# Altium schematic sheet Accelerometer.SchDoc
size A
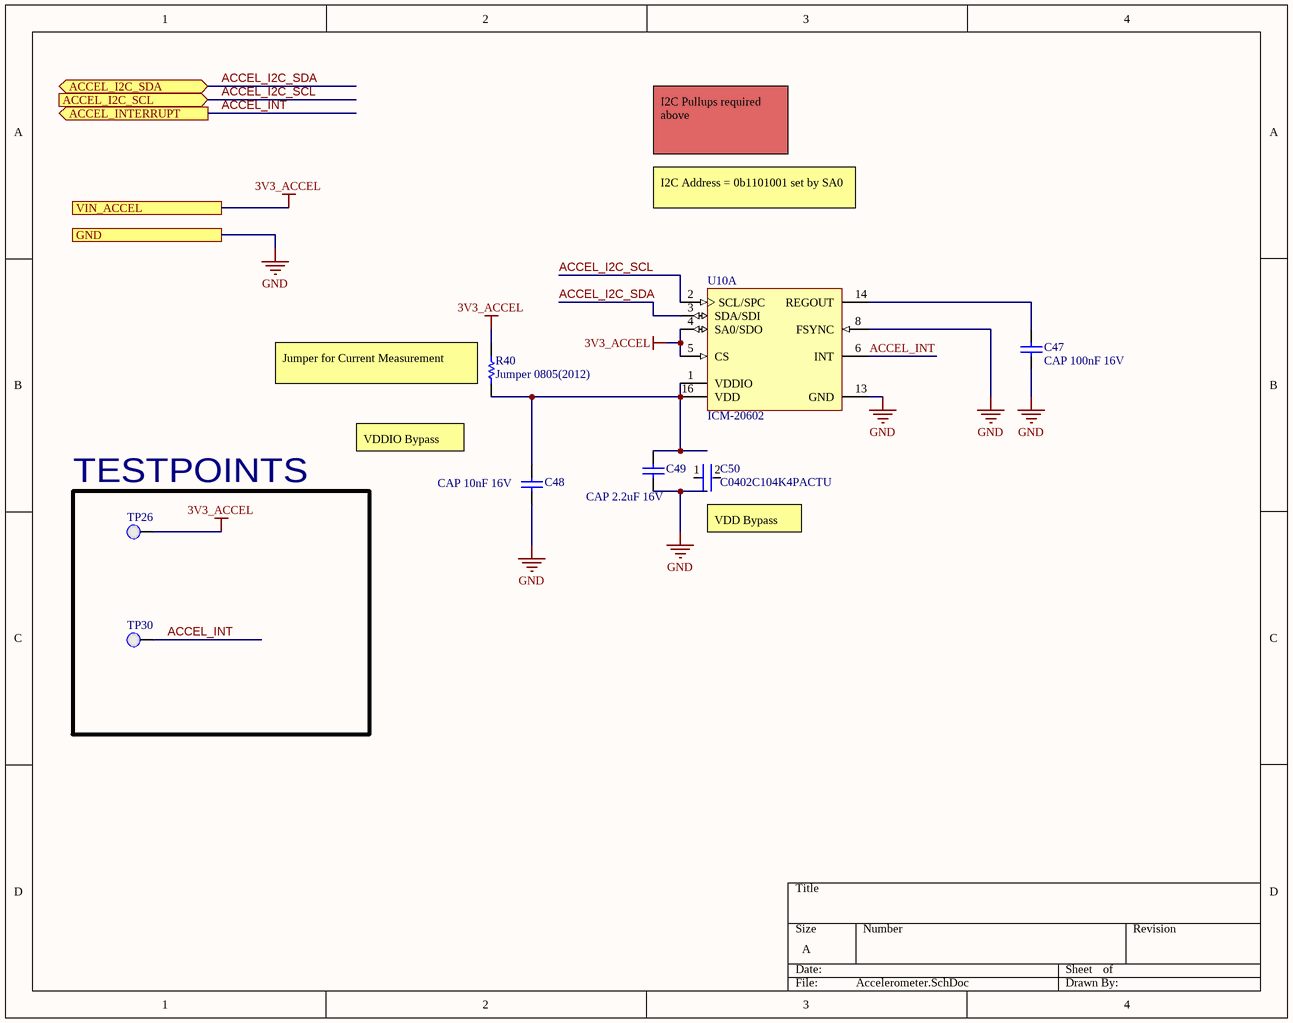
[diagram p0: Accelerometer.SchDoc]

## Parts
C47  CAP 100nF 16V  [CAPC0402(1005)60_M]
C48  CAP 10nF 16V  [CAPC0402(1005)33_L]
C49  CAP 2.2uF 16V  [CAPC0603(1608)100_L]
C50  C0402C104K4PACTU  [FP-C0402-BB-MFG]
R40  Jumper 0805(2012)  [RESC0805(2012)_N]
TP26  0.1" Pad  [PCBComponent]  (value not drawn)
TP30  0.1" Pad  [PCBComponent]  (value not drawn)
U10  ICM-20602  [INSE-I62-16]  (part A of 2)

## Blocks framed on the sheet
TESTPOINTS: TP26 TP30

## Ports
ACCEL_I2C_SCL (in), ACCEL_I2C_SDA (bidir), ACCEL_INTERRUPT (out), GND, VIN_ACCEL

## Nets
3V3_ACCEL: R40.1 TP26.1(PAD) U10.4(SA0/SDO) U10.5(CS) ; port VIN_ACCEL
GND: C47.1 C48.1 C49.1 U10.8(FSYNC) U10.13(GND) ; port GND
ACCEL_I2C_SCL: U10.2(SCL/SPC) ; port ACCEL_I2C_SCL
ACCEL_I2C_SDA: U10.3(SDA/SDI) ; port ACCEL_I2C_SDA
ACCEL_INT: TP30.1(PAD) U10.6(INT) ; port ACCEL_INTERRUPT
NetC47_2: C47.2 U10.14(REGOUT)
NetC48_2: C48.2 C49.2 R40.2 U10.1(VDDIO) U10.16(VDD)

Not connected (* = marked no-connect by the designer): C50 1 2

## Notes on the sheet
- I2C Pullups required above
- I2C Address = 0b1101001 set by SA0
- (near R40) Jumper for Current Measurement
- VDDIO Bypass
- (near C50) VDD Bypass

## Library data of the parts
C47 = CMP-1034-02069-1: CAP 100nF 16V ±10% 0402 (1005 Metric) Thickness 0.6mm SMD; Case-EIA: 0402; Case-Metric: 1005; Tolerance: Â±10%; Value: 100nF; Max Thickness: 0.6 mm; Rated Voltage: 16 V; Technology: SMT
C48 = CMP-1034-01875-1: CAP 10nF 16V ±10% 0402 (1005 Metric) Thickness 0.33mm SMD; Case-EIA: 0402; Tolerance: Â±10%; Case-Metric: 1005; Value: 10nF; Max Thickness: 0.33 mm; Rated Voltage: 16 V; Technology: SMT
C49 = CMP-1035-02763-1: CAP 2.2uF 16V ±10% 0603 (1608 Metric) Thickness 1mm SMD; Case-Metric: 1608; Case-EIA: 0603; Tolerance: Â±10%; Value: 2.2uF; Max Thickness: 1 mm; Technology: SMT; Rated Voltage: 16 V
C50 = CMP-1034-02069-4: CAP CER 0.1UF 16V 10% X5R 0402; Manufacturer: Kemet; Value: 0.10 μF; Tolerance: 0.1; Temperature Coefficient: 15%; Description: C0402 0.10 μF X5R 10.00% 16 V; Material: Ceramic; Package: C0402-BB; Lead Free: Yes; Manufacturer Part Number: C0402C104K4PACTU; Voltage Rating: 16 V; Temperature Characteristic: X5R; ComponentLink2URL: https://content.kemet.com/datasheets/KEM_C1002_X7R_SMD.pdf; ComponentLink2Description: Datasheet; Temperature Range Low: -55°C; Device Class L2: Capacitors; Octopart: https://octopart.com/c0402c104k4pactu-kemet-8375715; Device Class L1: Passive Components; Automotive: No; Height: 0.55mm; Mouser Description: Multilayer Ceramic Capacitors MLCC - SMD/SMT 16volts 0.1uF 10% X5R; Digikey Description: CAP CER 0.1UF 16V 10% X5R 0402; Temperature: -55°C to +125°C; Capacitance: 0.10 μF; Device Class L3: Ceramic Capacitors; Temperature Range High: +125°C; RoHS: TRUE; Category: Cap; Ipc Land Pattern Name: CAPC10050X50
R40 = CMP-1013-00001-1: Jumper 0805 (2012 Metric); Case-EIA: 0805; Value: 0.00 Ohm; Tolerance: None; Case-Metric: 2012; Technology: SMT; Power: None
TP26 TP30 = 0.1" Pad-A.4
U10 = CMP-2000-07589-1: High Performance 6-Axis MEMS MotionTracking(TM) Device, 1.71 to 3.45 V, -40 to 85 degC, 16-Pin LGA, RoHS; Manufacturer: InvenSense; Sensor Type: Temperature; Output Type: I2C; RoHSCompliant: True; Datasheet Version: Rev. 1.0, 10/2016; Datasheet URL: http://www.invensense.com/wp-content/uploads/2016/10/DS-000176-ICM-20602-v1.0.pdf; Min Operating Temperature: -40degC; Mounting Technology: SurfaceMount; Max Operating Temperature: 85degC; Manufacturer URL: http://www.invensense.com/; Package Reference: I62-16; Package Description: 16-Pin Land Grid Array, Body 3 x 3 mm, Pitch 0.5 mm